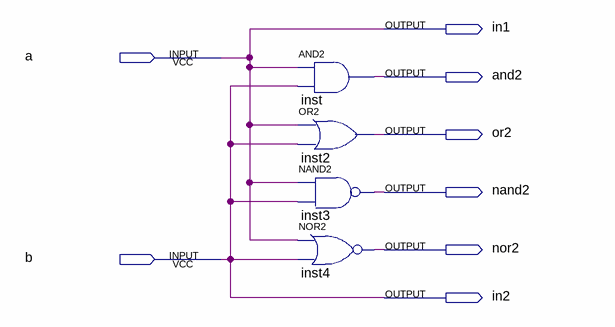
[diagram p0: schematic sheet]
// Quartus schematic lab2.bdf as structural Verilog: 4 symbols, 8 pins
module lab2 (
  input  a,
  input  b,
  output in1,
  output and2,
  output or2,
  output nand2,
  output nor2,
  output in2
);

  and inst (and2, a, b);
  or inst2 (or2, a, b);
  nand inst3 (nand2, a, b);
  nor inst4 (nor2, a, b);

  assign in1 = a;
  assign in2 = b;
endmodule
